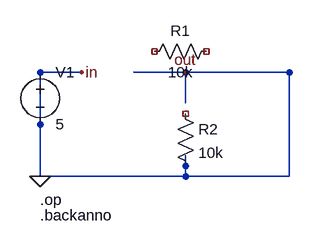
[diagram p0: schematic spannungsteiler.asc]
spannungsteiler.asc, the LTspice schematic file:
Version 4
SHEET 1 880 680
WIRE 112 144 48 144
WIRE 272 144 192 144
WIRE 432 144 272 144
WIRE 272 192 272 144
WIRE 272 304 272 272
WIRE 432 304 272 304
WIRE 432 144 432 144
WIRE 432 304 432 144
WIRE 48 304 48 144
WIRE 48 304 272 304
SYMBOL voltage 48 128 R0
WINDOW 123 0 0 Left 0
WINDOW 39 0 0 Left 0
SYMATTR InstName V1
SYMATTR Value 5
SYMBOL res 208 128 R270
WINDOW 0 32 56 VTop 2
WINDOW 3 0 56 VBottom 2
SYMATTR InstName R1
SYMATTR Value 10k
SYMBOL res 256 192 R0
SYMATTR InstName R2
SYMATTR Value 10k
FLAG 48 304 0
FLAG 112 144 in
FLAG 272 144 out
TEXT 48 340 Left 2 !.op
TEXT 48 364 Left 2 !.backanno

The netlist it stands for:
* spannungsteiler.asc
V1 0 0 5
R1 NC_01 NC_02 10k
R2 NC_03 0 10k
.op
.backanno
.backanno
.end